# Altium schematic sheet Block Diagram.SchDoc
size A4
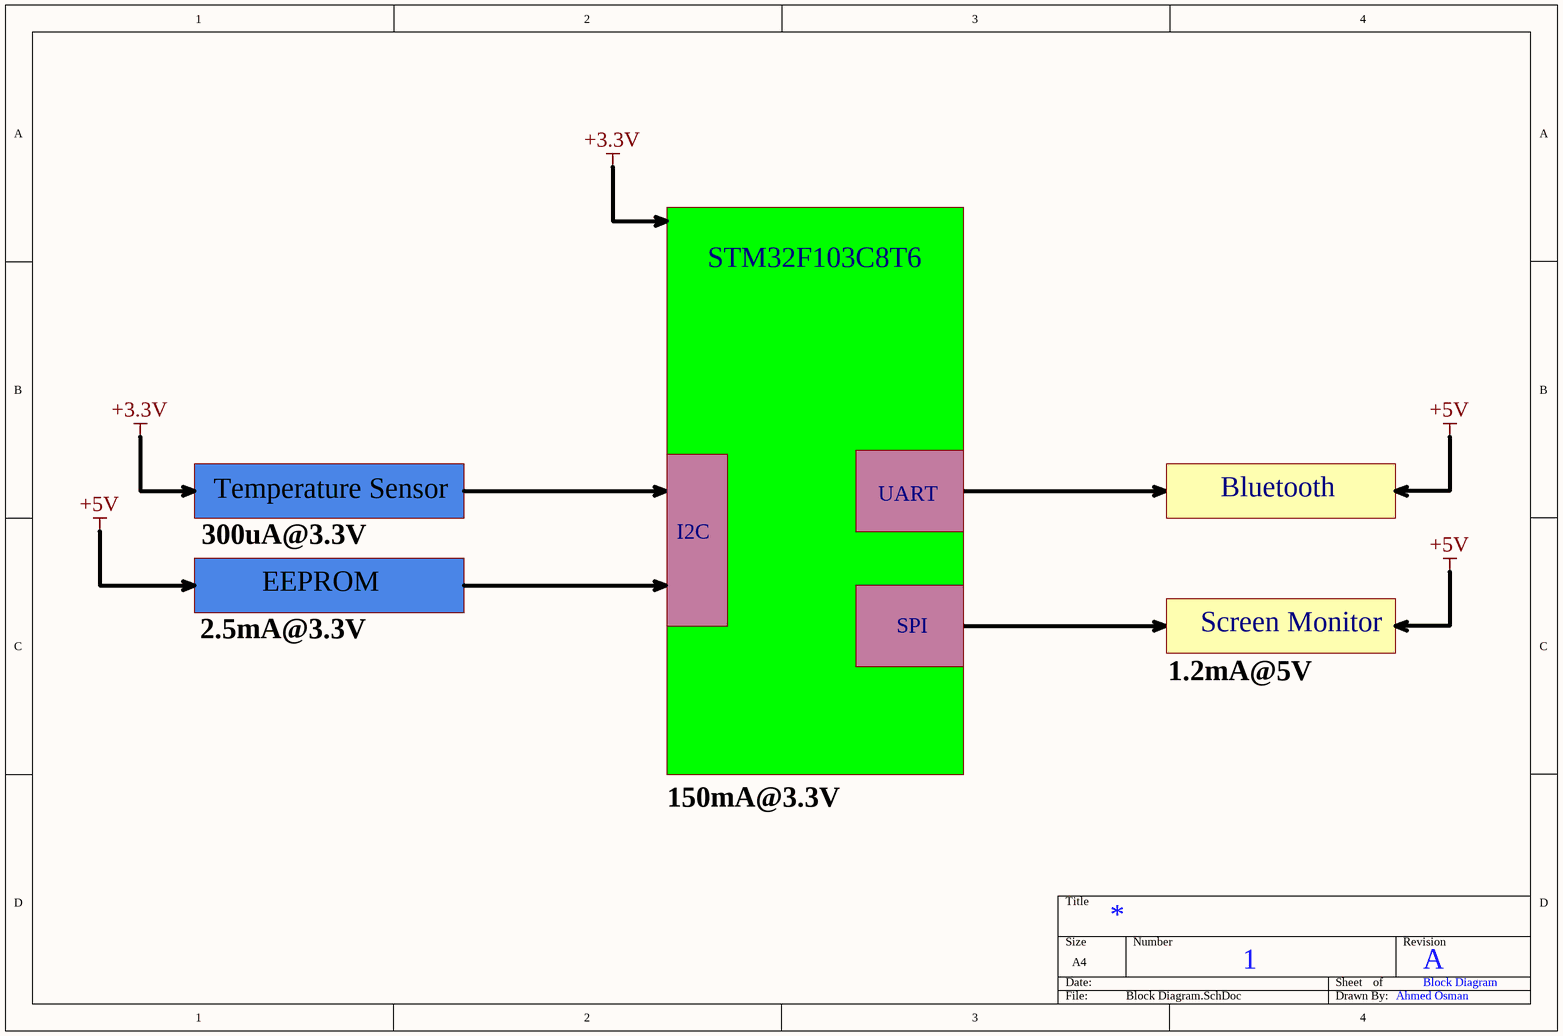
[diagram p0: Block Diagram.SchDoc]

## Notes on the sheet
- STM32F103C8T6
- Temperature Sensor
- UART
- Bluetooth
- 300uA@3.3V
- I2C
- 2.5mA@3.3V
- EEPROM
- SPI
- Screen Monitor
- 1.2mA@5V
- 150mA@3.3V
- 1
- A
- Block Diagram
- Ahmed Osman
- Labels drawn without touching a wire or pin: +3.3V, +5V